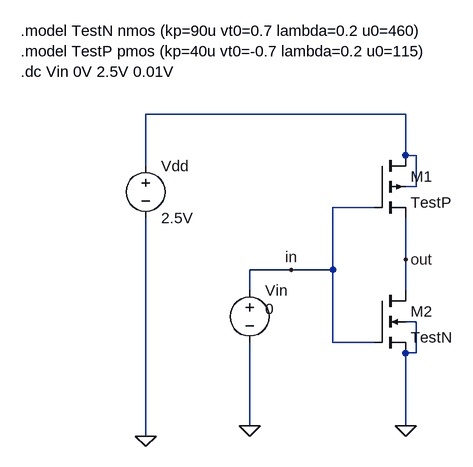
[diagram p0: schematic inverter.asc]
inverter.asc, the LTspice schematic file:
Version 4
SHEET 1 880 1316
WIRE -96 800 -496 800
WIRE -96 864 -96 800
WIRE -80 864 -96 864
WIRE -496 880 -496 800
WIRE -80 912 -80 864
WIRE -80 912 -96 912
WIRE -144 944 -208 944
WIRE -96 1024 -96 960
WIRE -272 1040 -336 1040
WIRE -208 1040 -208 944
WIRE -208 1040 -272 1040
WIRE -336 1072 -336 1040
WIRE -96 1072 -96 1024
WIRE -80 1120 -96 1120
WIRE -208 1152 -208 1040
WIRE -144 1152 -208 1152
WIRE -80 1168 -80 1120
WIRE -80 1168 -96 1168
WIRE -336 1280 -336 1152
WIRE -96 1280 -96 1168
WIRE -496 1296 -496 960
FLAG -496 1296 0
FLAG -96 1280 0
FLAG -336 1280 0
FLAG -96 1024 out
FLAG -272 1040 in
SYMBOL voltage -336 1056 R0
WINDOW 3 24 44 Left 2
SYMATTR Value 0
SYMATTR InstName Vin
SYMBOL voltage -496 864 R0
WINDOW 123 0 0 Left 2
WINDOW 39 0 0 Left 2
SYMATTR InstName Vdd
SYMATTR Value 2.5V
SYMBOL nmos4 -144 1072 R0
SYMATTR InstName M2
SYMATTR Value TestN
SYMATTR Value2 l=100u w=100u
SYMBOL pmos4 -144 864 R0
SYMATTR InstName M1
SYMATTR Value TestP
SYMATTR Value2 l=100u w=100u
TEXT -688 672 Left 2 !.model TestN nmos (kp=90u vt0=0.7 lambda=0.2 u0=460)\n.model TestP pmos (kp=40u vt0=-0.7 lambda=0.2 u0=115)\n.dc Vin 0V 2.5V 0.01V

The netlist it stands for:
* inverter.asc
Vin in 0 0
Vdd N001 0 2.5V
M2 out in 0 0 TestN l=100u w=100u
M1 N001 in out N001 TestP l=100u w=100u
.model NMOS NMOS
.model PMOS PMOS
.lib standard.mos
.model TestN nmos (kp=90u vt0=0.7 lambda=0.2 u0=460)
.model TestP pmos (kp=40u vt0=-0.7 lambda=0.2 u0=115)
.dc Vin 0V 2.5V 0.01V
.backanno
.end